# Altium project BAI1.PrjPcb
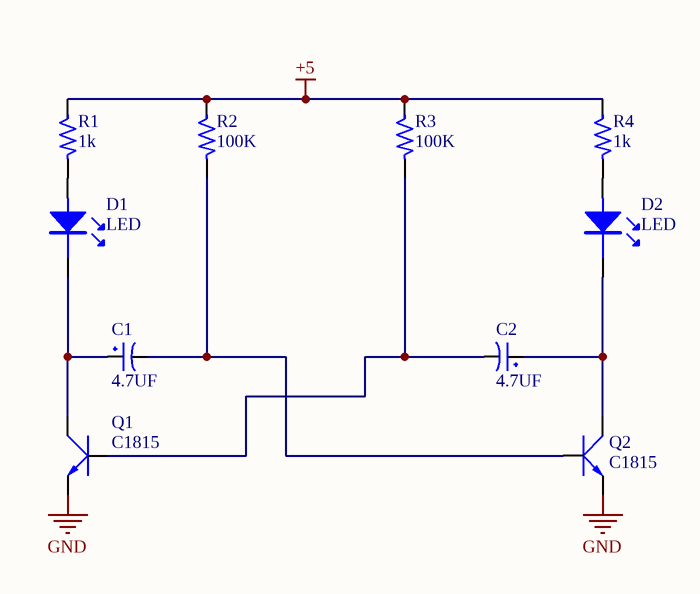
[diagram p0: BAI1.SchDoc]
1 sheet, 10 parts. Net scope: global (net labels, ports and power ports of the same name join across sheets).

## Sheet BAI1.SchDoc
size A; SheetNumber: 1; SheetTotal: 1

### Parts
C1  4.7UF  [CP1/2]
C2  4.7UF  [CP1/2]
D1  LED  [CAP10UF]
D2  LED  [CAP10UF]
Q1  C1815  [TO126]
Q2  C1815  [TO126]
R1  1k  [R1/6W]
R2  100K  [R1/6W]
R3  100K  [R1/6W]
R4  1k  [R1/6W]

### Nets
+5: R1.1 R2.1 R3.1 R4.1
GND: Q1.3(E) Q2.3(E)
NetC1_1: C1.1 D1.2 Q1.2(C)
NetC1_2: C1.2 Q2.1(B) R2.2
NetC2_1: C2.1 D2.2 Q2.2(C)
NetC2_2: C2.2 Q1.1(B) R3.2
NetD1_1: D1.1 R1.2
NetD2_1: D2.1 R4.2

### Library data of the parts
C1 C2 = CP1: Cap P  0,1uF < 22uF , 16 - 50V; Value: 10uF/50V; Description 1: 10 => 220uF/6,3V/10V - 10uF => 100uF/16V; Description 2: 0,1uF => 33uF/50V - 10uF => 22uF/63V; Description 3: 0,47uF => 10uF/100V
Q1 Q2 = C1815: NPN 600mW, ECB; Value: C1815
R1-R4 = Res: Resistor 1/4W; Value: R1/4W - 1K